# Altium schematic sheet GPS总图.SchDoc
size A4
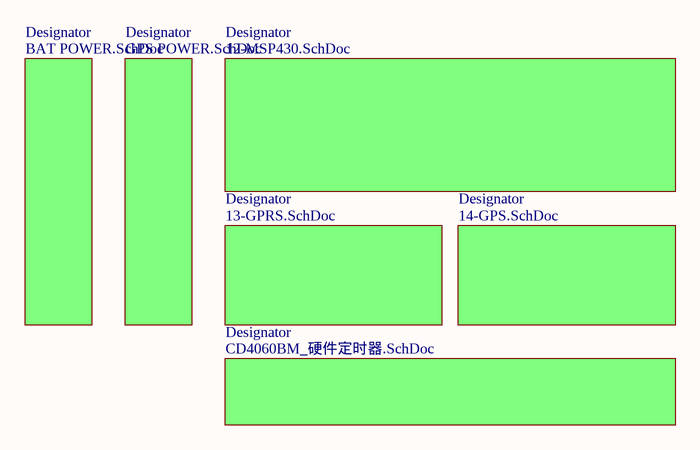
[diagram p0: GPS总图.SchDoc]

## Sub-sheets
Designator = 12-MSP430.SchDoc: no entries
Designator = 13-GPRS.SchDoc: no entries
Designator = 14-GPS.SchDoc: no entries
Designator = GPS POWER.SchDoc: no entries
Designator = BAT POWER.SchDoc: no entries
Designator = CD4060BM_硬件定时器.SchDoc: no entries